# EAGLE design WIFI-Switch (EAGLE 6.4)
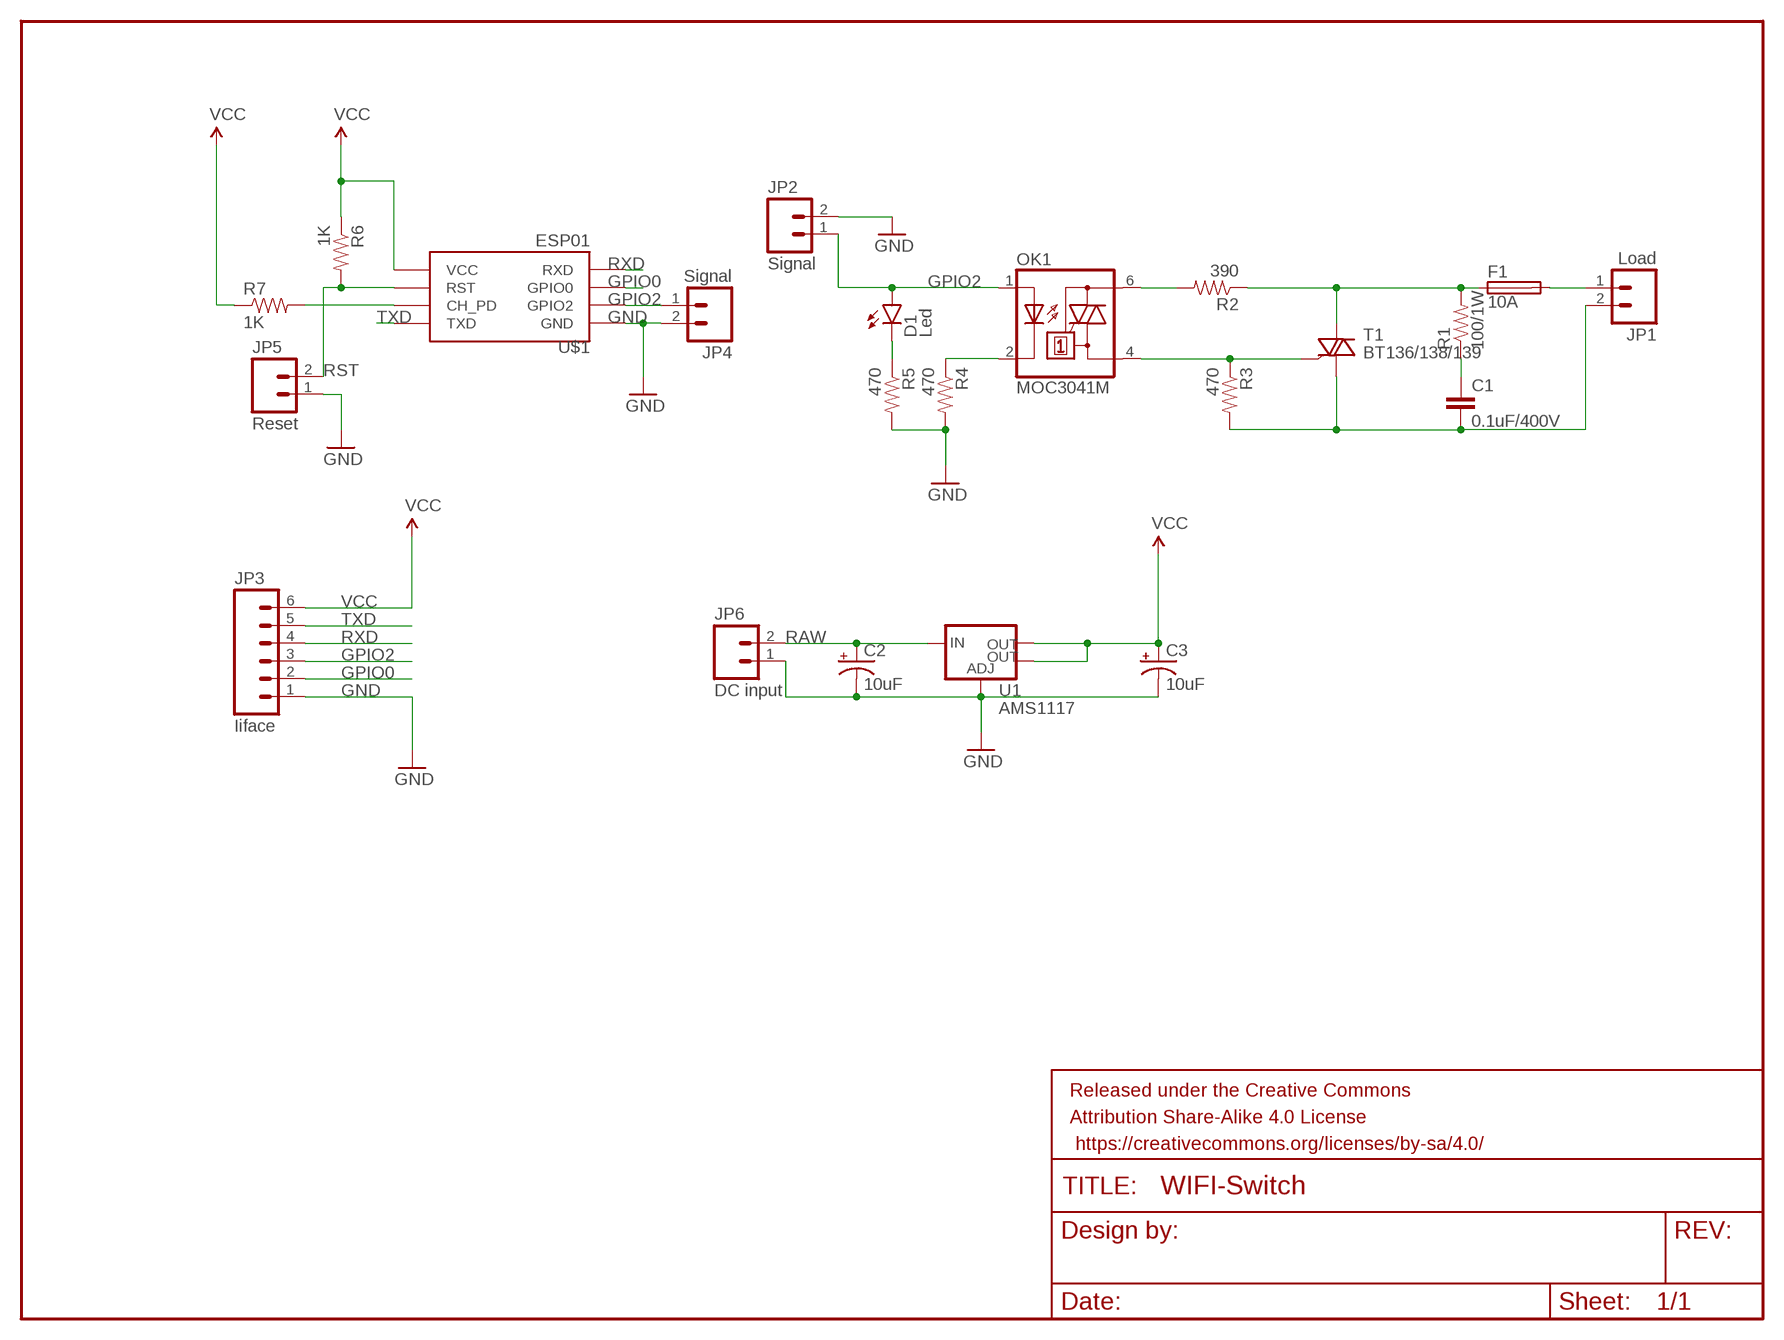
[diagram p0: schematic, sheet 1]

## Parts
C1  0.1uF/400V  C10/4  [C10B4]
C2  10uF  CAP_POL1206  [EIA3216]
C3  10uF  CAP_POL1206  [EIA3216]
D1  Led  LED3MM  [LED3MM]
F1  10A  SH22,5A  [SH22,5A]
FRAME1  FRAME-LETTER  [CREATIVE_COMMONS]
JP1  Load  M025MM  [SCREWTERMINAL-5MM-2]
JP2  Signal  M02LOCK  [1X02_LOCK]
JP3  Iiface  M06FEMALE_LOCK  [1X06_FEMALE_LOCK.010]
JP4  Signal  M02LOCK  [1X02_LOCK]
JP5  Reset  M02LOCK  [1X02_LOCK]
JP6  DC input  M02LOCK  [1X02_LOCK]
OK1  MOC3041M  [DIL06]
R1  100/1W  RESISTORPTH-2W  [AXIAL-0.8]
R2  390  RESISTORPTH-1/4W-VERT  [AXIAL-0.1]
R3  470  RESISTORPTH-1/4W  [AXIAL-0.4]
R4  470  RESISTORPTH-1/4W-VERT  [AXIAL-0.1]
R5  470  RESISTORPTH-1/4W-VERT  [AXIAL-0.1]
R6  1K  RESISTORPTH-1/4W-VERT  [AXIAL-0.1]
R7  1K  RESISTORPTH-1/4W-VERT  [AXIAL-0.1]
T1  BT136/138/139  BT138-V  [TO220BV]
U1  AMS1117  V_REG_LM1117SOT223  [SOT223]
U$1  ESP01  [ESP01]

## Nets
GND: C2.C(-) C3.C(-) JP2.2 JP3.1 JP4.2 JP5.1 JP6.1 R4.P$2 R5.P$2 U1.1(ADJ) U$1.GND
GPIO0: JP3.2 U$1.GPIO0
GPIO2: D1.A JP2.1 JP3.3 JP4.1 OK1.1(A) U$1.GPIO2
N$1: F1.2 JP1.1
N$2: R7.P$2 U$1.CH_PD
N$5: D1.K(C) R5.P$1
N$6: OK1.2(C) R4.P$1
N$19: OK1.6(A2) R2.P$2
N$20: F1.1 R1.P$2 R2.P$1 T1.T2(A2)
N$21: OK1.4(A1) R3.P$1 T1.G
N$22: C1.2 JP1.2 R3.P$2 T1.T1(A1)
N$23: C1.1 R1.P$1
RAW: C2.A(+) JP6.2 U1.3(IN)
RST: JP5.2 R6.P$2 U$1.RST
RXD: JP3.4 U$1.RX(RXD)
TXD: JP3.5 U$1.TX(TXD)
VCC: C3.A(+) JP3.6 R6.P$1 R7.P$1 U1.2(OUT) U1.4(OUT) U$1.VCC

## Library data of the parts
C1 = capacitor-wima:C: CAPACITOR naming: grid - package width
C2 C3 = SparkFun-Capacitors:CAP_POL: Capacitor Polarized These are standard SMD and PTH capacitors. Normally 10uF, 47uF, and 100uF in electrolytic and tantalum varieties. Always verify the external diameter of the through hole cap, it varies with capacity, voltage, and manufacturer. The EIA devices should be standard.
D1 = SparkFun-LED:LED: LEDs Standard schematic elements and footprints for 5mm, 3mm, 1206, and 0603 sized LEDs. 5mm - Spark Fun Electronics SKU : COM-00529 (and others)
F1 = fuse:SH22,5A: FUSE HOLDER grid 22,5mm, isolated cap OGN0031 8201, Schurter (Buerklin)
FRAME1 = SparkFun-Aesthetics:FRAME-LETTER: Schematic Frame Standard 8.5x11 US Letter frame
JP1 = SparkFun-Connectors:M02: Standard 2-pin 0.1" header. Use with - straight break away headers ( PRT-00116) - right angle break away headers (PRT-00553) - swiss pins (PRT-00743) - machine pins (PRT-00117) - female headers (PRT-00115) Molex polarized connector foot print use with: PRT-08233 with associated crimp pins and housings. 2.54_SCREWTERM for use with PRT-10571. 3.5mm Screw Terminal footprints for PRT-08084 5mm Screw Terminal footprints for use with PRT-08432; STOREFRONT_ID: PRT-08432
JP2 JP4-JP6 = SparkFun-Connectors:M02: Standard 2-pin 0.1" header. Use with - straight break away headers ( PRT-00116) - right angle break away headers (PRT-00553) - swiss pins (PRT-00743) - machine pins (PRT-00117) - female headers (PRT-00115) Molex polarized connector foot print use with: PRT-08233 with associated crimp pins and housings. 2.54_SCREWTERM for use with PRT-10571. 3.5mm Screw Terminal footprints for PRT-08084 5mm Screw Terminal footprints for use with PRT-08432
JP3 = SparkFun-Connectors:M06: Header 6 Standard 6-pin 0.1" header. Use with straight break away headers (SKU : PRT-00116), right angle break away headers (PRT-00553), swiss pins (PRT-00743), machine pins (PRT-00117), and female headers (PRT-00115). Molex polarized connector foot print use with SKU : PRT-08094 with associated crimp pins and housings. NOTES ON THE VARIANTS LOCK and LOCK_LONGPADS... This footprint was designed to help hold the alignment of a through-hole component (i.e. 6-pin header) while soldering it into place. You may notice that each hole has been shifted either up or down by 0.005 of an inch from it's more standard position (which is a perfectly straight line). This slight alteration caused the pins (the squares in the middle) to touch the edges of the holes. Because they are alternating, it causes a "brace" to hold the component in place. 0.005 has proven to be the perfect amount of "off-center" position when using our standard breakaway headers. Although looks a little odd when you look at the bare footprint, once you have a header in there, the alteration is very hard to notice. Also,if you push a header all the way into place, it is covered up entirely on the bottom side. This idea of altering the position of holes to aid alignment will be further integrated into the Sparkfun Library for other footprints. It can help hold any component with 3 or more connection pins.
OK1 = optocoupler:MOC30*: 6-Pin DIP Zero-Cross Optoisolators Triac Driver Output (250/400 Volt Peak) Source: http://www.fairchildsemi.com/ds/MO/MOC3043-M.pdf
R1-R7 = SparkFun-Resistors:RESISTOR: Resistor Basic schematic elements and footprints for 0603, 1206, and PTH resistors.
T1 = triac:BT138: TRIAC Source: http://www.semiconductors.philips.com BT138_SERIES_2.pdf
U1 = SparkFun-PowerIC:V_REG_LM1117: Voltage Regulator LM1117 Standard adjustable voltage regulator but in SMD form. Spark Fun Electronics SKU : COM-00595; PROD_ID: VREG-08170
U$1 = esp8266modules:ESP01: ESP8266 Wifi module 01

## Board
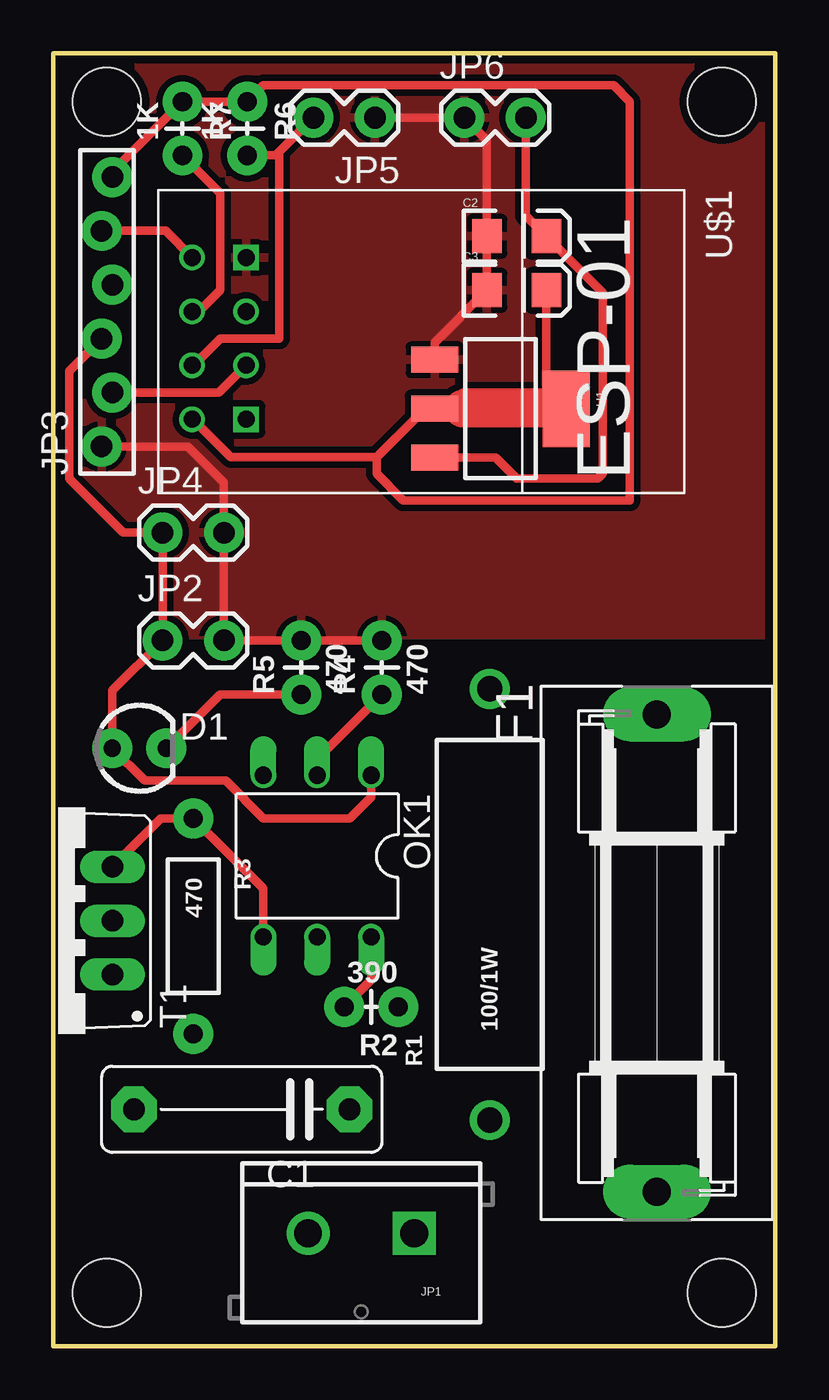
[diagram p1: board, top side]
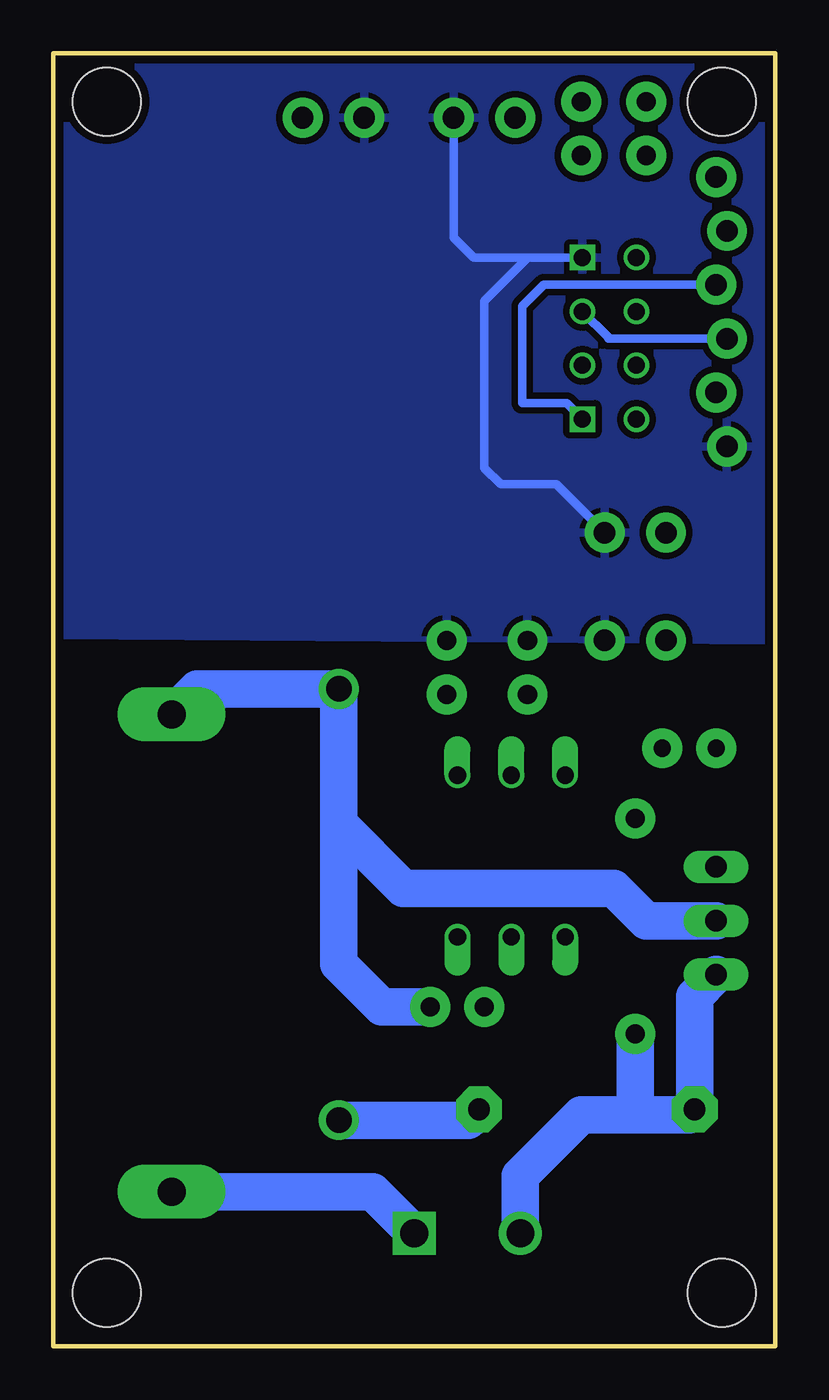
[diagram p2: board, bottom side, seen from below]

Size 34.04 x 60.96 mm. Coordinates in mm from the lower left corner, seen from the top.
Outline: 0,60.96 34.04,60.96 34.04,0 0,0 0,60.96
Copper layers (1*16): Top 0.0356mm / dielectric 1.5011mm / Bottom 0.0356mm
Design rules "LaenPCBOrder": minimum track width 6mil, minimum drill 13mil, track to track 6mil, track to pad 6mil, pad to pad 6mil, via to via 6mil, smd to smd 6mil, copper to edge 15mil, drill to drill 6mil, minimum pad ring 7mil, minimum via ring 7mil, stop-mask expansion 3mil, vias tented up to drill 0mil, thermal gap 10mil
Holes 3.2 mm at 2.54,58.67 31.5,58.67 31.5,2.54 2.54,2.54

### Footprints (pad centres in the part's own frame; a part is rotated, then mirrored left to right if it is on the bottom)
C10B4 = drill 1.016 pad 2.159 octagon: 1 -5.08,0; 2 5.08,0
EIA3216 = smd 1.4 x 1.6: A 1.4,0; C -1.4,0
LED3MM = drill 0.813 pad 1.88: A -1.27,0; K 1.27,0
SH22,5A = drill 1.321 pad 2.54 long: 1 -11.252,0; 2 11.252,0
SCREWTERMINAL-5MM-2 = drill 1.3 pad 2.032 square: 1 0,0 | drill 1.3 pad 2.032: 2 5,0
1X02_LOCK = drill 1.016 pad 1.88: 1 -0.178,0; 2 2.718,0
1X06_FEMALE_LOCK.010 = drill 1.016 pad 1.88: 1 0,0.254; 2 2.54,-0.254; 3 5.08,0.254; 4 7.62,-0.254; 5 10.16,0.254; 6 12.7,-0.254
DIL06 = drill 0.813 offset: 1 -2.54,-3.81; 2 0,-3.81; 3 2.54,-3.81; 4 2.54,3.81; 5 0,3.81; 6 -2.54,3.81
AXIAL-0.8 = drill 1.2 pad 1.88: P$1 -10.16,0; P$2 10.16,0
AXIAL-0.1 = drill 0.9 pad 1.88: P$1 0,0; P$2 2.54,0
AXIAL-0.4 = drill 0.9 pad 1.88: P$1 -5.08,0; P$2 5.08,0
TO220BV = drill 1.016 long: G 2.54,-2.54; T1 -2.54,-2.54; T2 0,-2.54
SOT223 = smd 1.219 x 2.235: 1 -2.311,-3.099; 2 0,-3.099; 3 2.311,-3.099 | smd 3.6 x 2.2: 4 0,3.099
ESP01 = drill 0.8: CH_PD -1.285,-8.178; GPIO0 1.255,-5.638; GPIO2 -1.285,-5.638; RST 1.255,-8.178; TX -3.825,-8.178; VCC 3.795,-8.178 | drill 0.8 square: GND -3.825,-5.638; RX 3.795,-5.638

### Placement (x,y rotation side)
C1  8.89,11.18 180 top
C2  21.84,52.32 0 top
C3  21.84,49.78 0 top
D1  4.06,28.19 0 top
F1  28.45,18.54 270 top
FRAME1  -5.84,-18.54 0 top  (outside the outline)
JP1  17.02,5.33 180 top
JP2  5.33,33.27 0 top
JP3  2.54,42.42 90 top
JP4  5.33,38.35 0 top
JP5  14.99,57.91 180 top
JP6  19.56,57.91 0 top
OK1  12.45,23.11 180 top
R1  20.57,20.83 90 top
R2  16.26,16 180 top
R3  6.6,19.81 270 top
R4  15.49,30.73 90 top
R5  11.68,30.73 90 top
R6  9.14,58.67 270 top
R7  6.1,58.67 270 top
T1  0.25,20.07 90 top
U1  21.08,44.2 270 top
U$1  14.73,47.5 270 top

### Tracks (layer width: path | path; a pad name or v marks a point on that pad's centre or on a via)
GND
  Top 0.406: R4.P$2 R5.P$2 JP2.2 JP4.2 8.05,40.72 6.35,42.42 JP3.1 | JP5.1 JP6.1 20.44,56.85 C3.C | C3.C C2.C | U1.1 17.98,47.32 C3.C
  Bottom 0.406: JP5.1 15.16,52.25 14.22,51.31 9.11,51.31 U$1.GND 11.67,51.32 13.72,49.28 13.72,41.4 12.95,40.64 10.34,40.64 JP4.2
  pour Top (isolate 0.305): 0,33.53 34.04,33.53 34.04,60.96 0.25,60.96 0.25,59.69
  pour Bottom (isolate 0.305): 0,33.27 34.04,33.53 34.04,60.96 0,60.96
GPIO0
  Top 0.406: U$1.GPIO0 7.81,44.96 JP3.2
GPIO2
  Top 0.406: JP3.3 0.76,45.97 0.76,40.89 3.3,38.35 JP4.1 JP2.1 2.79,30.91 D1.A 4.32,26.67 8.13,26.67 9.91,24.89 13.97,24.89 14.99,25.91 OK1.1
  Bottom 0.406: U$1.GPIO2 7.87,47.56 7.87,47.5 JP3.3
N$1
  Bottom 1.778: F1.2 18.97,7.29 JP1.1
N$2
  Top 0.406: U$1.CH_PD 6.87,48.78 7.87,49.78 7.87,54.36 R7.P$2
N$5
  Top 0.406: D1.K 7.87,30.73 R5.P$1
N$6
  Top 0.406: OK1.2 12.45,27.69 R4.P$1
N$19
  Top 0.406: OK1.6 14.99,17.27 R2.P$2
N$20
  Bottom 1.778: R2.P$1 18.54,16 20.57,18.03 20.57,24.64 | 20.57,24.64 R1.P$2 27.25,30.99 F1.1 | T1.T2 6.1,20.07 7.62,21.59 17.53,21.59 20.57,24.64
N$21
  Top 0.406: T1.G 5.08,24.89 R3.P$1 9.91,21.59 OK1.4
N$22
  Bottom 1.778: JP1.2 12.02,8.05 9.14,10.92 6.86,10.92 | 6.86,10.92 4.06,10.92 C1.2 3.81,16.51 T1.T1 | R3.P$2 6.6,11.18 6.86,10.92
N$23
  Bottom 1.778: R1.P$1 14.48,10.67 C1.1
RAW
  Top 0.406: JP6.2 22.28,53.29 C2.A 25.91,49.66 25.91,41.15 25.65,40.89 21.84,40.89 20.85,41.88 U1.3
RST
  Top 0.406: U$1.RST 6.62,46.24 7.87,47.5 10.67,47.5 10.67,56.31 | R6.P$2 10.49,56.13 10.67,56.31 | JP5.2 11.09,56.73 10.67,56.31
RXD
  Bottom 0.406: U$1.RX 9.84,44.45 11.94,44.45 11.94,49.02 10.92,50.04 JP3.4
TXD
  Top 0.406: U$1.TX 5.3,52.58 JP3.5
VCC
  Top 0.406: JP3.6 2.79,55.37 R7.P$1 R6.P$1 9.91,59.44 26.42,59.44 27.18,58.67 27.18,39.88 16.51,39.88 15.24,41.15 15.24,41.91 | U$1.VCC 6.59,43.7 8.38,41.91 15.24,41.91 | 15.24,41.91 17.53,44.2 U1.2 19.3,44.2 | C3.A 23.24,45.08 23.37,44.96 19.3,44.96 18.8,44.45 19.05,44.2 24.13,44.2
  Top 1.778: U1.4 24.13,44.2 19.3,44.2